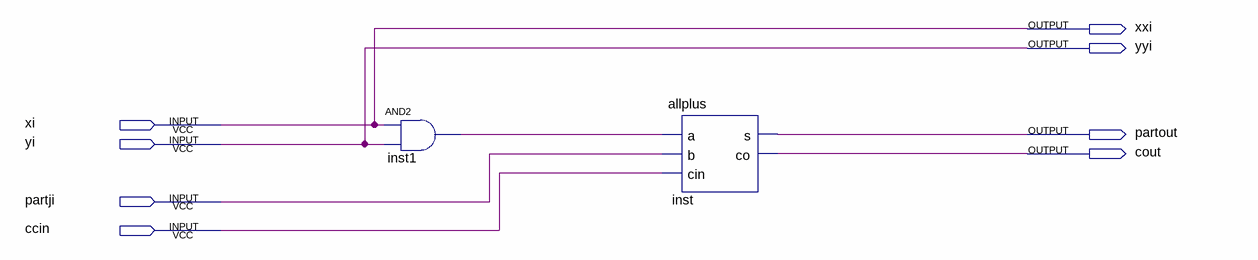
[diagram p0: schematic sheet]
// Quartus schematic danyuan.bdf as structural Verilog: 2 symbols, 8 pins
module danyuan (
  input  xi,
  input  yi,
  input  partji,
  input  ccin,
  output xxi,
  output yyi,
  output partout,
  output cout
);

  wire inst1_out;

  and inst1 (inst1_out, xi, yi);
  allplus inst (.a(inst1_out), .b(partji), .cin(ccin), .s(partout), .co(cout));

  assign xxi = xi;
  assign yyi = yi;
endmodule
